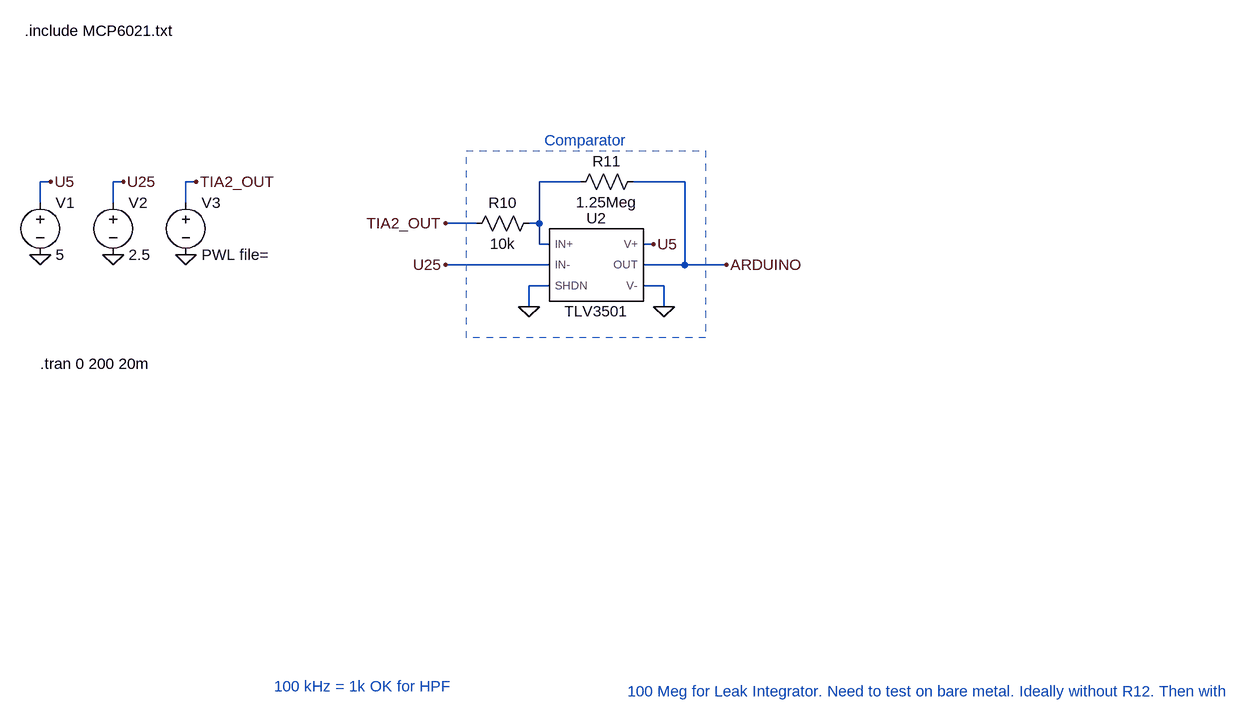
[diagram p0: schematic Odbiornik_TLV3501_ONLY.asc]
Odbiornik_TLV3501_ONLY.asc, the LTspice schematic file:
Version 4.1
SHEET 1 2432 1780
WIRE -400 480 -416 480
WIRE -288 480 -304 480
WIRE -176 480 -192 480
WIRE 416 480 352 480
WIRE 576 480 496 480
WIRE -416 512 -416 480
WIRE -304 512 -304 480
WIRE -192 512 -192 480
WIRE 256 544 208 544
WIRE 352 544 352 480
WIRE 352 544 336 544
WIRE 352 576 352 544
WIRE 368 576 352 576
WIRE 528 576 512 576
WIRE 368 608 208 608
WIRE 576 608 576 480
WIRE 576 608 512 608
WIRE 640 608 576 608
WIRE 368 640 336 640
WIRE 544 640 512 640
WIRE 336 672 336 640
WIRE 544 672 544 640
FLAG -416 592 0
FLAG -304 592 0
FLAG 640 608 ARDUINO
FLAG 208 544 TIA2_OUT
FLAG 208 608 U25
FLAG 336 672 0
FLAG 544 672 0
FLAG 528 576 U5
FLAG -400 480 U5
FLAG -288 480 U25
FLAG -192 592 0
FLAG -176 480 TIA2_OUT
SYMBOL voltage -416 496 R0
WINDOW 123 0 0 Left 0
WINDOW 39 0 0 Left 0
SYMATTR InstName V1
SYMATTR Value 5
SYMBOL voltage -304 496 R0
WINDOW 123 0 0 Left 0
WINDOW 39 0 0 Left 0
SYMATTR InstName V2
SYMATTR Value 2.5
SYMBOL Modules\\TLV3501 432 608 R0
SYMATTR InstName U2
SYMBOL res 352 528 R90
WINDOW 0 0 56 VBottom 2
WINDOW 3 32 56 VTop 2
SYMATTR InstName R10
SYMATTR Value 10k
SYMBOL res 512 464 R90
WINDOW 0 0 56 VBottom 2
WINDOW 3 32 56 VTop 2
SYMATTR InstName R11
SYMATTR Value 1.25Meg
SYMBOL voltage -192 496 R0
WINDOW 123 0 0 Left 0
WINDOW 39 0 0 Left 0
SYMATTR InstName V3
SYMATTR Value PWL file=
TEXT -416 760 Left 2 !.tran 0 200 20m
TEXT -440 248 Left 2 !.include MCP6021.txt
TEXT -56 1256 Left 2 ;100 kHz = 1k OK for HPF
TEXT 360 416 Left 2 ;Comparator
TEXT 488 1264 Left 2 ;100 Meg for Leak Integrator. Need to test on bare metal. Ideally without R12. Then with
RECTANGLE Normal 608 720 240 432 1

The netlist it stands for:
* Odbiornik_TLV3501_ONLY.asc
V1 U5 0 5
V2 U25 0 2.5
X§U2 N001 U25 0 U5 0 ARDUINO TLV3501  ; pins IN+ IN- SHDN V+ V- OUT
R10 N001 TIA2_OUT 10k
R11 ARDUINO N001 1.25Meg
V3 TIA2_OUT 0 PWL file=
.tran 0 200 20m
.include MCP6021.txt
* 100 kHz = 1k OK for HPF
* Comparator
* 100 Meg for Leak Integrator. Need to test on bare metal. Ideally without R12. Then with
.lib tlv3501.lib
.backanno
.end